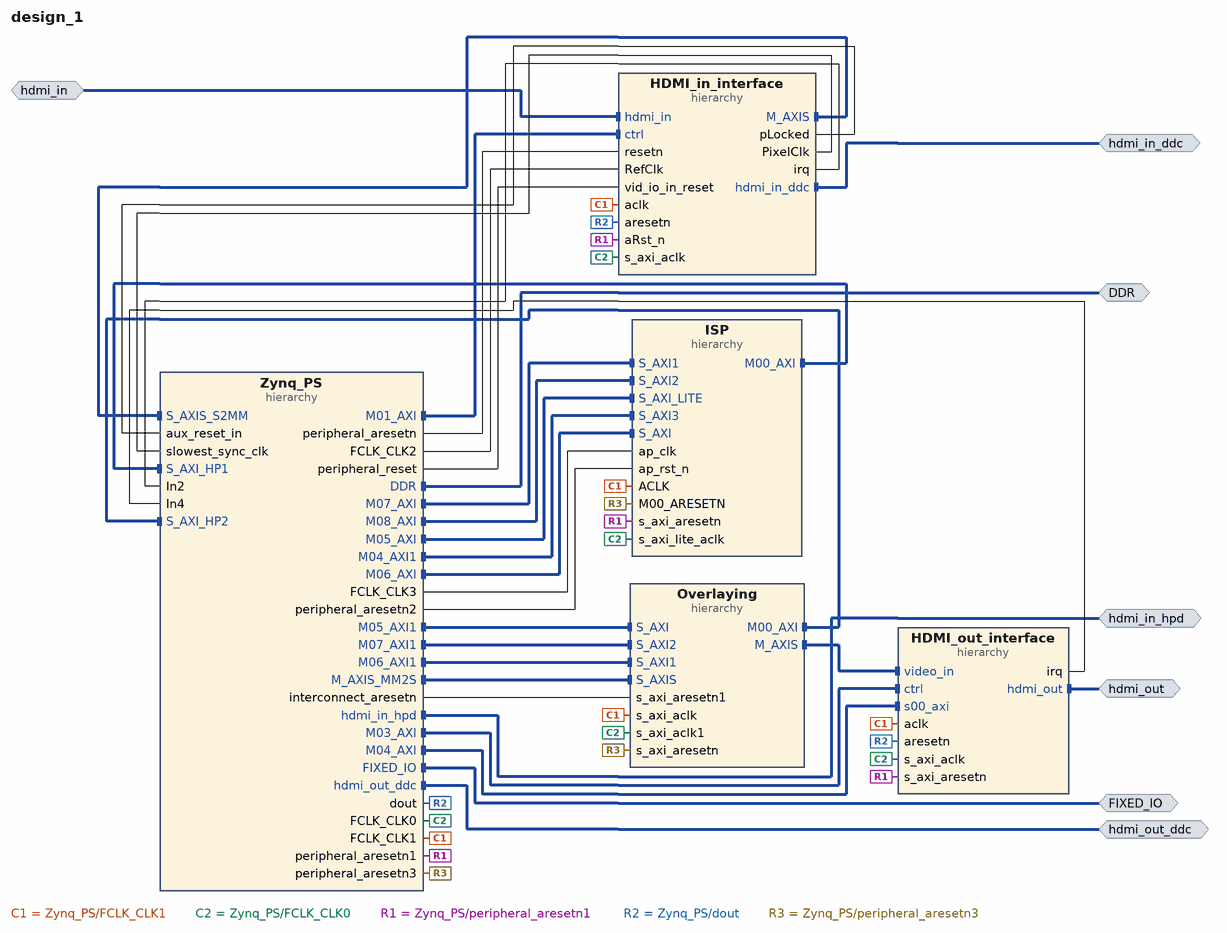
[diagram p0: block diagram of the top level]
# Vivado block design design_1, xc7z020clg400-1, Vivado 2020.2
create_bd_design design_1

create_bd_intf_port -mode Master -vlnv xilinx.com:interface:ddrx_rtl:1.0 DDR
create_bd_intf_port -mode Master -vlnv xilinx.com:display_processing_system7:fixedio_rtl:1.0 FIXED_IO
create_bd_intf_port -mode Slave -vlnv digilentinc.com:interface:tmds_rtl:1.0 hdmi_in
create_bd_intf_port -mode Master -vlnv xilinx.com:interface:iic_rtl:1.0 hdmi_in_ddc
create_bd_intf_port -mode Master -vlnv xilinx.com:interface:gpio_rtl:1.0 hdmi_in_hpd
create_bd_intf_port -mode Master -vlnv digilentinc.com:interface:tmds_rtl:1.0 hdmi_out
create_bd_intf_port -mode Master -vlnv xilinx.com:interface:iic_rtl:1.0 hdmi_out_ddc

create_bd_cell -type hier Zynq_PS
create_bd_cell -type hier HDMI_in_interface
create_bd_cell -type hier HDMI_out_interface
create_bd_cell -type hier ISP
create_bd_cell -type hier Overlaying

# ---- hierarchy /Zynq_PS ----
current_bd_instance /Zynq_PS
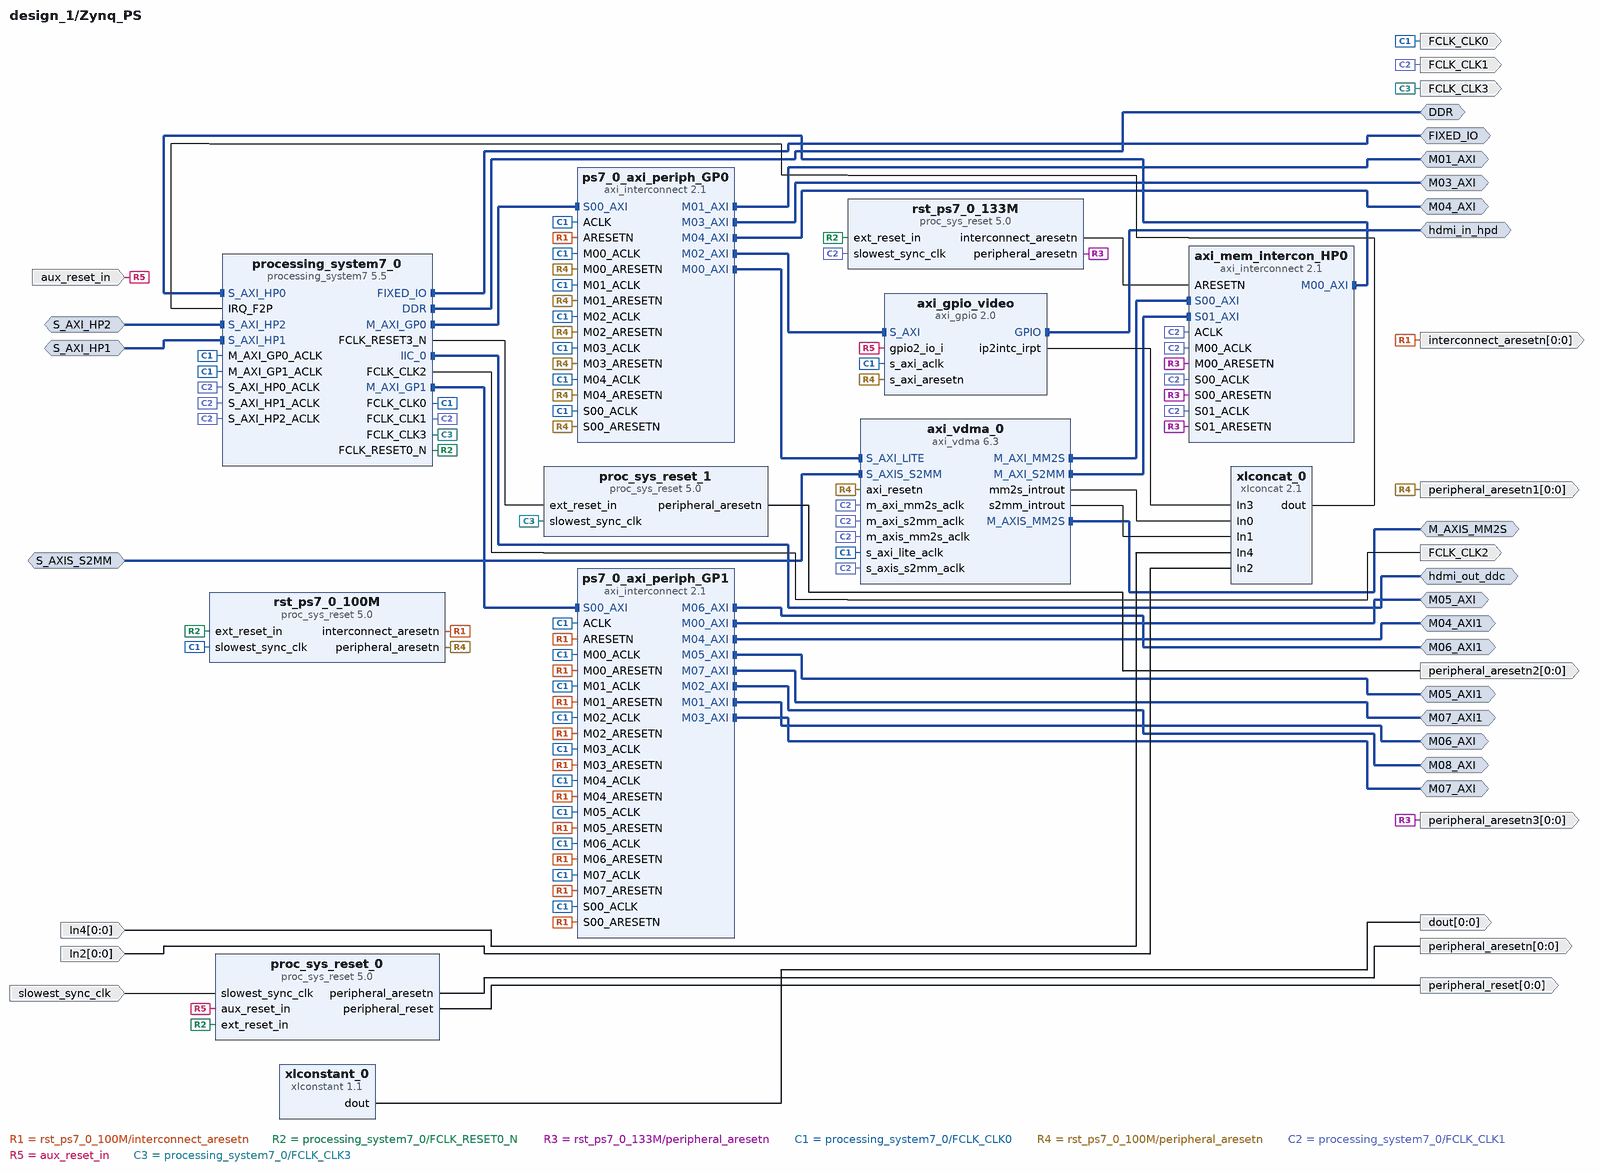
[diagram p1: block diagram inside /Zynq_PS]
create_bd_intf_pin -mode Master -vlnv xilinx.com:interface:ddrx_rtl:1.0 DDR
create_bd_intf_pin -mode Master -vlnv xilinx.com:display_processing_system7:fixedio_rtl:1.0 FIXED_IO
create_bd_intf_pin -mode Master -vlnv xilinx.com:interface:iic_rtl:1.0 hdmi_out_ddc
create_bd_intf_pin -mode Master -vlnv xilinx.com:interface:aximm_rtl:1.0 M03_AXI
create_bd_intf_pin -mode Master -vlnv xilinx.com:interface:axis_rtl:1.0 M_AXIS_MM2S
create_bd_intf_pin -mode Master -vlnv xilinx.com:interface:aximm_rtl:1.0 M04_AXI
create_bd_intf_pin -mode Master -vlnv xilinx.com:interface:aximm_rtl:1.0 M01_AXI
create_bd_intf_pin -mode Slave -vlnv xilinx.com:interface:axis_rtl:1.0 S_AXIS_S2MM
create_bd_intf_pin -mode Master -vlnv xilinx.com:interface:gpio_rtl:1.0 hdmi_in_hpd
create_bd_intf_pin -mode Master -vlnv xilinx.com:interface:aximm_rtl:1.0 M05_AXI
create_bd_intf_pin -mode Master -vlnv xilinx.com:interface:aximm_rtl:1.0 M06_AXI
create_bd_intf_pin -mode Master -vlnv xilinx.com:interface:aximm_rtl:1.0 M07_AXI
create_bd_intf_pin -mode Master -vlnv xilinx.com:interface:aximm_rtl:1.0 M08_AXI
create_bd_intf_pin -mode Slave -vlnv xilinx.com:interface:aximm_rtl:1.0 S_AXI_HP1
create_bd_intf_pin -mode Master -vlnv xilinx.com:interface:aximm_rtl:1.0 M04_AXI1
create_bd_intf_pin -mode Master -vlnv xilinx.com:interface:aximm_rtl:1.0 M05_AXI1
create_bd_intf_pin -mode Master -vlnv xilinx.com:interface:aximm_rtl:1.0 M06_AXI1
create_bd_intf_pin -mode Slave -vlnv xilinx.com:interface:aximm_rtl:1.0 S_AXI_HP2
create_bd_intf_pin -mode Master -vlnv xilinx.com:interface:aximm_rtl:1.0 M07_AXI1
create_bd_pin -dir O -from 0 -to 0 -type rst peripheral_aresetn
create_bd_pin -dir I -from 0 -to 0 In4
create_bd_pin -dir O -type clk FCLK_CLK0
create_bd_pin -dir O -from 0 -to 0 -type rst peripheral_aresetn1
create_bd_pin -dir O -type clk FCLK_CLK2
create_bd_pin -dir O -from 0 -to 0 -type rst peripheral_reset
create_bd_pin -dir O -from 0 -to 0 dout
create_bd_pin -dir O -type clk FCLK_CLK1
create_bd_pin -dir I -type rst aux_reset_in
create_bd_pin -dir I -type clk slowest_sync_clk
create_bd_pin -dir I -from 0 -to 0 In2
create_bd_pin -dir O -type clk FCLK_CLK3
create_bd_pin -dir O -from 0 -to 0 -type rst peripheral_aresetn2
create_bd_pin -dir O -from 0 -to 0 -type rst peripheral_aresetn3
create_bd_pin -dir O -from 0 -to 0 -type rst interconnect_aresetn

create_bd_cell -type ip -vlnv xilinx.com:ip:axi_interconnect:2.1 ps7_0_axi_periph_GP0
set_property -dict {CONFIG.NUM_MI 5} [get_bd_cells ps7_0_axi_periph_GP0]
create_bd_cell -type ip -vlnv xilinx.com:ip:processing_system7:5.5 processing_system7_0
set_property -dict [list \
  CONFIG.PCW_APU_PERIPHERAL_FREQMHZ 667 \
  CONFIG.PCW_ENET0_ENET0_IO {MIO 16 .. 27} \
  CONFIG.PCW_ENET0_GRP_MDIO_ENABLE 1 \
  CONFIG.PCW_ENET0_GRP_MDIO_IO {MIO 52 .. 53} \
  CONFIG.PCW_ENET0_PERIPHERAL_ENABLE 1 \
  CONFIG.PCW_ENET0_RESET_ENABLE 0 \
  CONFIG.PCW_ENET_RESET_ENABLE 1 \
  CONFIG.PCW_ENET_RESET_SELECT {Share reset pin} \
  CONFIG.PCW_EN_CLK1_PORT 1 \
  CONFIG.PCW_EN_CLK2_PORT 1 \
  CONFIG.PCW_EN_CLK3_PORT 1 \
  CONFIG.PCW_EN_RST3_PORT 1 \
  CONFIG.PCW_FCLK1_PERIPHERAL_CLKSRC {DDR PLL} \
  CONFIG.PCW_FCLK_CLK1_BUF TRUE \
  CONFIG.PCW_FCLK_CLK2_BUF TRUE \
  CONFIG.PCW_FCLK_CLK3_BUF TRUE \
  CONFIG.PCW_FPGA0_PERIPHERAL_FREQMHZ 100 \
  CONFIG.PCW_FPGA1_PERIPHERAL_FREQMHZ 133 \
  CONFIG.PCW_FPGA2_PERIPHERAL_FREQMHZ 200 \
  CONFIG.PCW_FPGA3_PERIPHERAL_FREQMHZ 100 \
  CONFIG.PCW_FPGA_FCLK1_ENABLE 1 \
  CONFIG.PCW_FPGA_FCLK2_ENABLE 1 \
  CONFIG.PCW_FPGA_FCLK3_ENABLE 1 \
  CONFIG.PCW_GPIO_MIO_GPIO_ENABLE 1 \
  CONFIG.PCW_GPIO_MIO_GPIO_IO MIO \
  CONFIG.PCW_I2C0_I2C0_IO EMIO \
  CONFIG.PCW_I2C0_PERIPHERAL_ENABLE 1 \
  CONFIG.PCW_I2C_PERIPHERAL_FREQMHZ 111.111115 \
  CONFIG.PCW_I2C_RESET_ENABLE 1 \
  CONFIG.PCW_I2C_RESET_SELECT {Share reset pin} \
  CONFIG.PCW_IRQ_F2P_INTR 1 \
  CONFIG.PCW_PRESET_BANK1_VOLTAGE {LVCMOS 1.8V} \
  CONFIG.PCW_QSPI_GRP_FBCLK_ENABLE 1 \
  CONFIG.PCW_QSPI_GRP_FBCLK_IO {MIO 8} \
  CONFIG.PCW_QSPI_GRP_SINGLE_SS_ENABLE 1 \
  CONFIG.PCW_QSPI_GRP_SINGLE_SS_IO {MIO 1 .. 6} \
  CONFIG.PCW_QSPI_PERIPHERAL_ENABLE 1 \
  CONFIG.PCW_QSPI_QSPI_IO {MIO 1 .. 6} \
  CONFIG.PCW_SD0_GRP_CD_ENABLE 1 \
  CONFIG.PCW_SD0_GRP_CD_IO {MIO 47} \
  CONFIG.PCW_SD0_GRP_WP_ENABLE 0 \
  CONFIG.PCW_SD0_PERIPHERAL_ENABLE 1 \
  CONFIG.PCW_SD0_SD0_IO {MIO 40 .. 45} \
  CONFIG.PCW_SDIO_PERIPHERAL_FREQMHZ 50 \
  CONFIG.PCW_SINGLE_QSPI_DATA_MODE x4 \
  CONFIG.PCW_UART1_PERIPHERAL_ENABLE 1 \
  CONFIG.PCW_UART1_UART1_IO {MIO 48 .. 49} \
  CONFIG.PCW_UART_PERIPHERAL_FREQMHZ 100 \
  CONFIG.PCW_UIPARAM_DDR_FREQ_MHZ 533.333333 \
  CONFIG.PCW_UIPARAM_DDR_MEMORY_TYPE {DDR 3 (Low Voltage)} \
  CONFIG.PCW_UIPARAM_DDR_PARTNO {MT41K256M16 RE-125} \
  CONFIG.PCW_USB0_PERIPHERAL_ENABLE 1 \
  CONFIG.PCW_USB0_RESET_ENABLE 1 \
  CONFIG.PCW_USB0_RESET_IO {MIO 46} \
  CONFIG.PCW_USB0_USB0_IO {MIO 28 .. 39} \
  CONFIG.PCW_USB_RESET_ENABLE 1 \
  CONFIG.PCW_USB_RESET_SELECT {Share reset pin} \
  CONFIG.PCW_USE_FABRIC_INTERRUPT 1 \
  CONFIG.PCW_USE_M_AXI_GP1 1 \
  CONFIG.PCW_USE_S_AXI_HP0 1 \
  CONFIG.PCW_USE_S_AXI_HP1 1 \
  CONFIG.PCW_USE_S_AXI_HP2 1 \
] [get_bd_cells processing_system7_0]
# 298 more settings of processing_system7_0 are not shown: defaults, MIO pin electricals, DDR timing, and values the tool derives
create_bd_cell -type ip -vlnv xilinx.com:ip:axi_vdma:6.3 axi_vdma_0
set_property -dict [list \
  CONFIG.c_m_axis_mm2s_tdata_width 24 \
  CONFIG.c_mm2s_linebuffer_depth 2048 \
  CONFIG.c_s2mm_linebuffer_depth 2048 \
  CONFIG.c_s2mm_max_burst_length 32 \
] [get_bd_cells axi_vdma_0]
create_bd_cell -type ip -vlnv xilinx.com:ip:xlconcat:2.1 xlconcat_0
set_property -dict {CONFIG.NUM_PORTS 5 CONFIG.dout_width 5} [get_bd_cells xlconcat_0]
create_bd_cell -type ip -vlnv xilinx.com:ip:xlconstant:1.1 xlconstant_0
create_bd_cell -type ip -vlnv xilinx.com:ip:axi_interconnect:2.1 axi_mem_intercon_HP0
set_property -dict {CONFIG.NUM_MI 1 CONFIG.NUM_SI 2} [get_bd_cells axi_mem_intercon_HP0]
create_bd_cell -type ip -vlnv xilinx.com:ip:proc_sys_reset:5.0 proc_sys_reset_0
create_bd_cell -type ip -vlnv xilinx.com:ip:proc_sys_reset:5.0 rst_ps7_0_100M
create_bd_cell -type ip -vlnv xilinx.com:ip:proc_sys_reset:5.0 rst_ps7_0_133M
create_bd_cell -type ip -vlnv xilinx.com:ip:axi_gpio:2.0 axi_gpio_video
set_property -dict [list \
  CONFIG.C_ALL_INPUTS_2 1 \
  CONFIG.C_ALL_OUTPUTS 1 \
  CONFIG.C_GPIO2_WIDTH 1 \
  CONFIG.C_GPIO_WIDTH 1 \
  CONFIG.C_INTERRUPT_PRESENT 1 \
  CONFIG.C_IS_DUAL 1 \
] [get_bd_cells axi_gpio_video]
create_bd_cell -type ip -vlnv xilinx.com:ip:proc_sys_reset:5.0 proc_sys_reset_1
create_bd_cell -type ip -vlnv xilinx.com:ip:axi_interconnect:2.1 ps7_0_axi_periph_GP1
set_property -dict {CONFIG.NUM_MI 8} [get_bd_cells ps7_0_axi_periph_GP1]

# ---- hierarchy /HDMI_in_interface ----
current_bd_instance /HDMI_in_interface
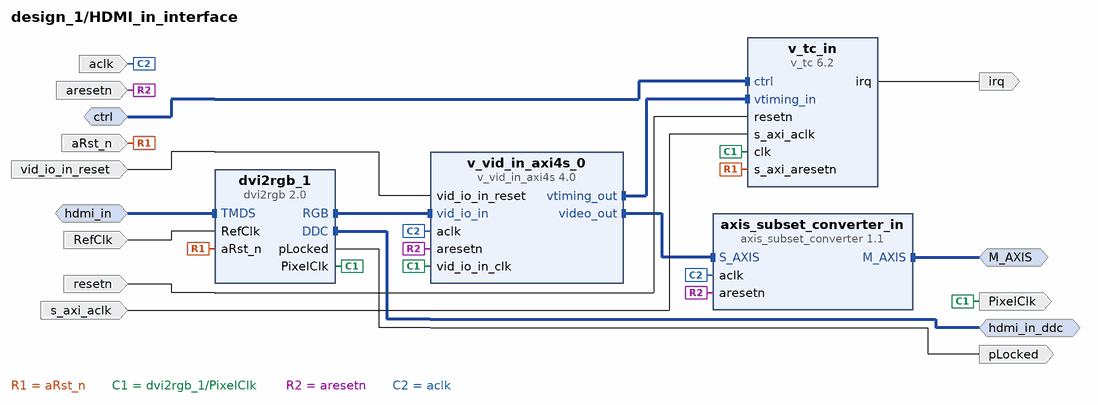
[diagram p2: block diagram inside /HDMI_in_interface]
create_bd_intf_pin -mode Slave -vlnv digilentinc.com:interface:tmds_rtl:1.0 hdmi_in
create_bd_intf_pin -mode Master -vlnv xilinx.com:interface:iic_rtl:1.0 hdmi_in_ddc
create_bd_intf_pin -mode Slave -vlnv xilinx.com:interface:aximm_rtl:1.0 ctrl
create_bd_intf_pin -mode Master -vlnv xilinx.com:interface:axis_rtl:1.0 M_AXIS
create_bd_pin -dir I -type rst aRst_n
create_bd_pin -dir O -type clk PixelClk
create_bd_pin -dir I -type clk RefClk
create_bd_pin -dir O pLocked
create_bd_pin -dir I -type rst vid_io_in_reset
create_bd_pin -dir I -type rst aresetn
create_bd_pin -dir I -type clk aclk
create_bd_pin -dir I -type rst resetn
create_bd_pin -dir O -type intr irq
create_bd_pin -dir I -type clk s_axi_aclk

create_bd_cell -type ip -vlnv digilentinc.com:ip:dvi2rgb:2.0 dvi2rgb_1
set_property -dict [list \
  CONFIG.IIC_BOARD_INTERFACE hdmi_in_ddc \
  CONFIG.TMDS_BOARD_INTERFACE hdmi_in \
  CONFIG.kAddBUFG false \
  CONFIG.kClkRange 1 \
  CONFIG.kDebug false \
  CONFIG.kEdidFileName dgl_1080p_cea.data \
  CONFIG.kRstActiveHigh false \
] [get_bd_cells dvi2rgb_1]
create_bd_cell -type ip -vlnv xilinx.com:ip:v_vid_in_axi4s:4.0 v_vid_in_axi4s_0
set_property -dict {CONFIG.C_ADDR_WIDTH 12 CONFIG.C_HAS_ASYNC_CLK 1} [get_bd_cells v_vid_in_axi4s_0]
create_bd_cell -type ip -vlnv xilinx.com:ip:v_tc:6.2 v_tc_in
set_property -dict [list \
  CONFIG.HAS_INTC_IF true \
  CONFIG.enable_generation false \
  CONFIG.horizontal_blank_detection false \
  CONFIG.vertical_blank_detection false \
] [get_bd_cells v_tc_in]
create_bd_cell -type ip -vlnv xilinx.com:ip:axis_subset_converter:1.1 axis_subset_converter_in
set_property -dict [list \
  CONFIG.M_HAS_TLAST 1 \
  CONFIG.M_TDATA_NUM_BYTES 3 \
  CONFIG.M_TUSER_WIDTH 1 \
  CONFIG.S_HAS_TLAST 1 \
  CONFIG.S_HAS_TREADY 1 \
  CONFIG.S_TDATA_NUM_BYTES 3 \
  CONFIG.S_TUSER_WIDTH 1 \
  CONFIG.TDATA_REMAP {tdata[23:16],tdata[7:0],tdata[15:8]} \
  CONFIG.TLAST_REMAP {tlast[0]} \
  CONFIG.TUSER_REMAP {tuser[0:0]} \
] [get_bd_cells axis_subset_converter_in]

# ---- hierarchy /HDMI_out_interface ----
current_bd_instance /HDMI_out_interface
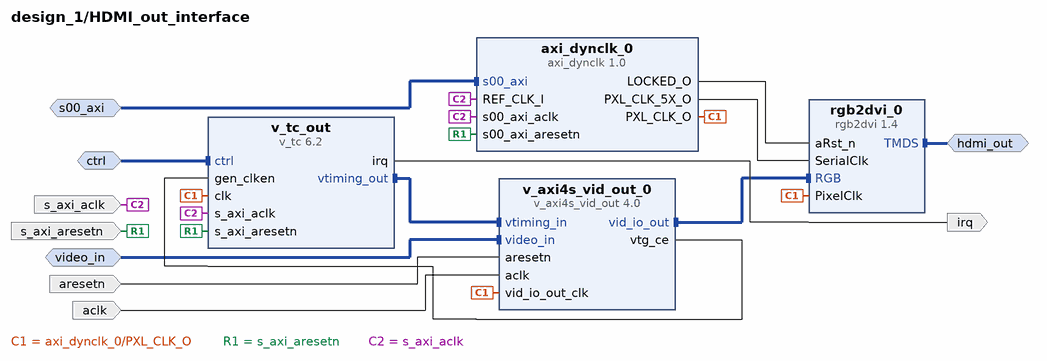
[diagram p3: block diagram inside /HDMI_out_interface]
create_bd_intf_pin -mode Master -vlnv digilentinc.com:interface:tmds_rtl:1.0 hdmi_out
create_bd_intf_pin -mode Slave -vlnv xilinx.com:interface:aximm_rtl:1.0 ctrl
create_bd_intf_pin -mode Slave -vlnv xilinx.com:interface:aximm_rtl:1.0 s00_axi
create_bd_intf_pin -mode Slave -vlnv xilinx.com:interface:axis_rtl:1.0 video_in
create_bd_pin -dir I -type rst aresetn
create_bd_pin -dir I -type clk aclk
create_bd_pin -dir I -type rst s_axi_aresetn
create_bd_pin -dir O -type intr irq
create_bd_pin -dir I -type clk s_axi_aclk

create_bd_cell -type ip -vlnv digilentinc.com:ip:rgb2dvi:1.4 rgb2dvi_0
set_property -dict [list \
  CONFIG.TMDS_BOARD_INTERFACE hdmi_out \
  CONFIG.kGenerateSerialClk false \
  CONFIG.kRstActiveHigh false \
] [get_bd_cells rgb2dvi_0]
create_bd_cell -type ip -vlnv xilinx.com:ip:v_axi4s_vid_out:4.0 v_axi4s_vid_out_0
set_property -dict {CONFIG.C_ADDR_WIDTH 12 CONFIG.C_HAS_ASYNC_CLK 1 CONFIG.C_VTG_MASTER_SLAVE 1} [get_bd_cells v_axi4s_vid_out_0]
create_bd_cell -type ip -vlnv xilinx.com:ip:v_tc:6.2 v_tc_out
set_property -dict {CONFIG.enable_detection false} [get_bd_cells v_tc_out]
create_bd_cell -type ip -vlnv digilentinc.com:ip:axi_dynclk:1.0 axi_dynclk_0

# ---- hierarchy /ISP ----
current_bd_instance /ISP
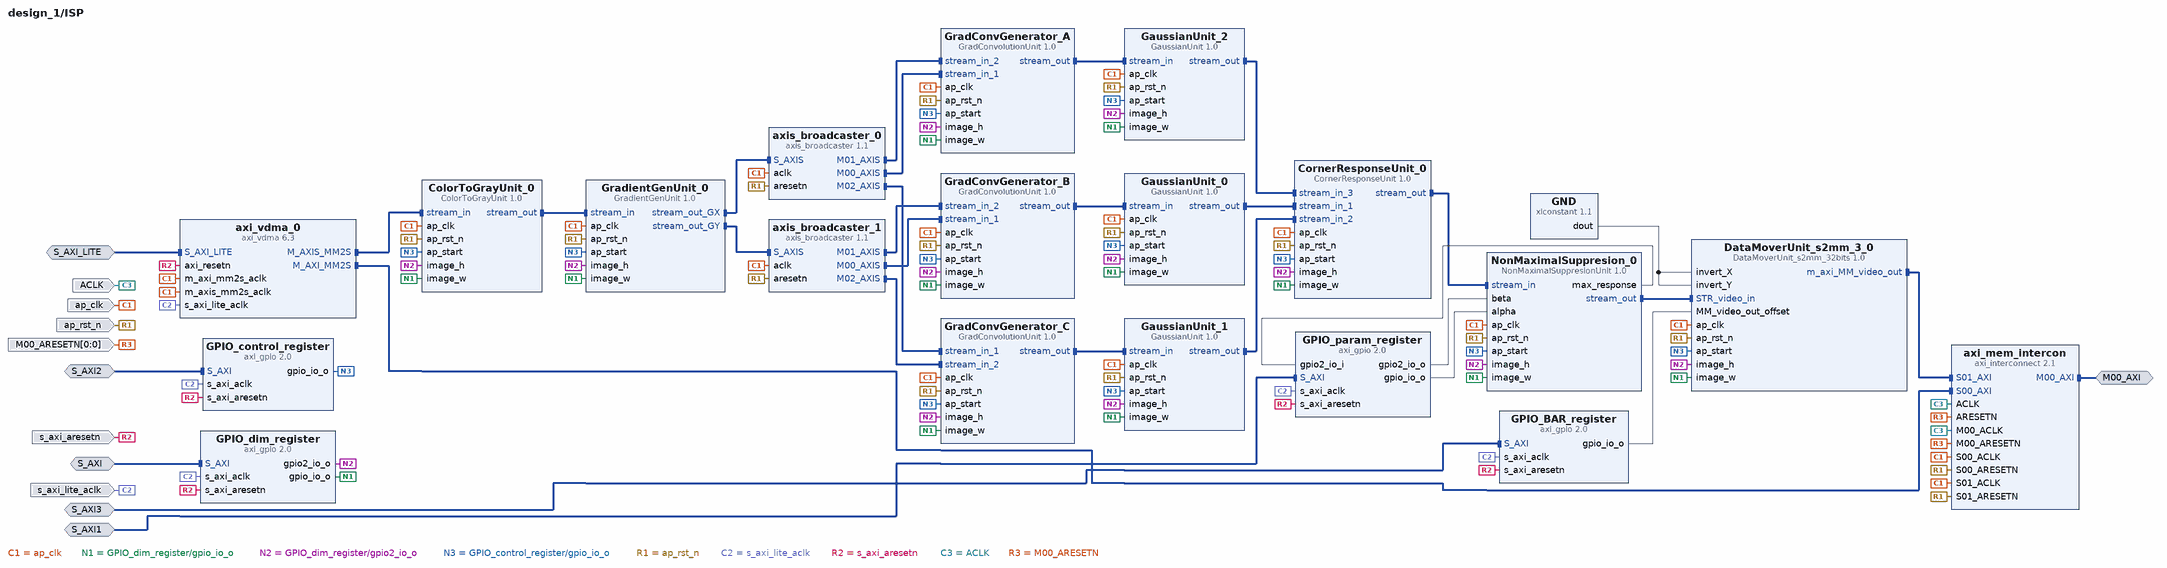
[diagram p4: block diagram inside /ISP]
create_bd_intf_pin -mode Slave -vlnv xilinx.com:interface:aximm_rtl:1.0 S_AXI_LITE
create_bd_intf_pin -mode Slave -vlnv xilinx.com:interface:aximm_rtl:1.0 S_AXI
create_bd_intf_pin -mode Slave -vlnv xilinx.com:interface:aximm_rtl:1.0 S_AXI1
create_bd_intf_pin -mode Slave -vlnv xilinx.com:interface:aximm_rtl:1.0 S_AXI2
create_bd_intf_pin -mode Master -vlnv xilinx.com:interface:aximm_rtl:1.0 M00_AXI
create_bd_intf_pin -mode Slave -vlnv xilinx.com:interface:aximm_rtl:1.0 S_AXI3
create_bd_pin -dir I -type clk ap_clk
create_bd_pin -dir I -type rst ap_rst_n
create_bd_pin -dir I -type clk s_axi_lite_aclk
create_bd_pin -dir I -type rst s_axi_aresetn
create_bd_pin -dir I -type clk ACLK
create_bd_pin -dir I -from 0 -to 0 -type rst M00_ARESETN

create_bd_cell -type ip -vlnv Deverene:DVR-002:GradientGenUnit:1.0 GradientGenUnit_0
create_bd_cell -type ip -vlnv xilinx.com:ip:axis_broadcaster:1.1 axis_broadcaster_0
set_property -dict {CONFIG.M02_TDATA_REMAP {tdata[7:0]} CONFIG.NUM_MI 3} [get_bd_cells axis_broadcaster_0]
create_bd_cell -type ip -vlnv Deverne:DVR-002:GradConvolutionUnit:1.0 GradConvGenerator_A
create_bd_cell -type ip -vlnv Deverne:DVR-002:GradConvolutionUnit:1.0 GradConvGenerator_B
create_bd_cell -type ip -vlnv xilinx.com:ip:axis_broadcaster:1.1 axis_broadcaster_1
set_property -dict {CONFIG.M02_TDATA_REMAP {tdata[7:0]} CONFIG.NUM_MI 3} [get_bd_cells axis_broadcaster_1]
create_bd_cell -type ip -vlnv Deverne:DVR-002:GradConvolutionUnit:1.0 GradConvGenerator_C
create_bd_cell -type ip -vlnv Deverne:DVR-002:GaussianUnit:1.0 GaussianUnit_0
create_bd_cell -type ip -vlnv Deverne:DVR-002:GaussianUnit:1.0 GaussianUnit_1
create_bd_cell -type ip -vlnv Deverne:DVR-002:GaussianUnit:1.0 GaussianUnit_2
create_bd_cell -type ip -vlnv Deverne:DVR-002:CornerResponseUnit:1.0 CornerResponseUnit_0
create_bd_cell -type ip -vlnv xilinx.com:ip:axi_vdma:6.3 axi_vdma_0
set_property -dict [list \
  CONFIG.c_include_s2mm 0 \
  CONFIG.c_m_axis_mm2s_tdata_width 24 \
  CONFIG.c_mm2s_linebuffer_depth 2048 \
  CONFIG.c_num_fstores 1 \
] [get_bd_cells axi_vdma_0]
create_bd_cell -type ip -vlnv xilinx.com:ip:axi_gpio:2.0 GPIO_dim_register
set_property -dict {CONFIG.C_ALL_OUTPUTS 1 CONFIG.C_ALL_OUTPUTS_2 1 CONFIG.C_IS_DUAL 1} [get_bd_cells GPIO_dim_register]
create_bd_cell -type ip -vlnv xilinx.com:ip:axi_gpio:2.0 GPIO_param_register
set_property -dict [list \
  CONFIG.C_ALL_OUTPUTS 1 \
  CONFIG.C_ALL_OUTPUTS_2 0 \
  CONFIG.C_GPIO2_WIDTH 16 \
  CONFIG.C_GPIO_WIDTH 16 \
  CONFIG.C_IS_DUAL 1 \
] [get_bd_cells GPIO_param_register]
create_bd_cell -type ip -vlnv xilinx.com:ip:axi_gpio:2.0 GPIO_control_register
set_property -dict {CONFIG.C_ALL_OUTPUTS 1 CONFIG.C_GPIO_WIDTH 1 CONFIG.C_IS_DUAL 0} [get_bd_cells GPIO_control_register]
create_bd_cell -type ip -vlnv xilinx.com:ip:axi_interconnect:2.1 axi_mem_intercon
set_property -dict {CONFIG.NUM_MI 1 CONFIG.NUM_SI 2} [get_bd_cells axi_mem_intercon]
create_bd_cell -type ip -vlnv Deverne:DVR-002:ColorToGrayUnit:1.0 ColorToGrayUnit_0
create_bd_cell -type ip -vlnv Boutigny_L:PH920:DataMoverUnit_s2mm_32bits:1.0 DataMoverUnit_s2mm_3_0
create_bd_cell -type ip -vlnv xilinx.com:ip:axi_gpio:2.0 GPIO_BAR_register
set_property -dict {CONFIG.C_ALL_OUTPUTS 1 CONFIG.C_IS_DUAL 0} [get_bd_cells GPIO_BAR_register]
create_bd_cell -type ip -vlnv xilinx.com:ip:xlconstant:1.1 GND
set_property -dict {CONFIG.CONST_VAL 0} [get_bd_cells GND]
create_bd_cell -type ip -vlnv Deverne:DVR-002:NonMaximalSuppresionUnit:1.0 NonMaximalSuppresion_0

# ---- hierarchy /Overlaying ----
current_bd_instance /Overlaying
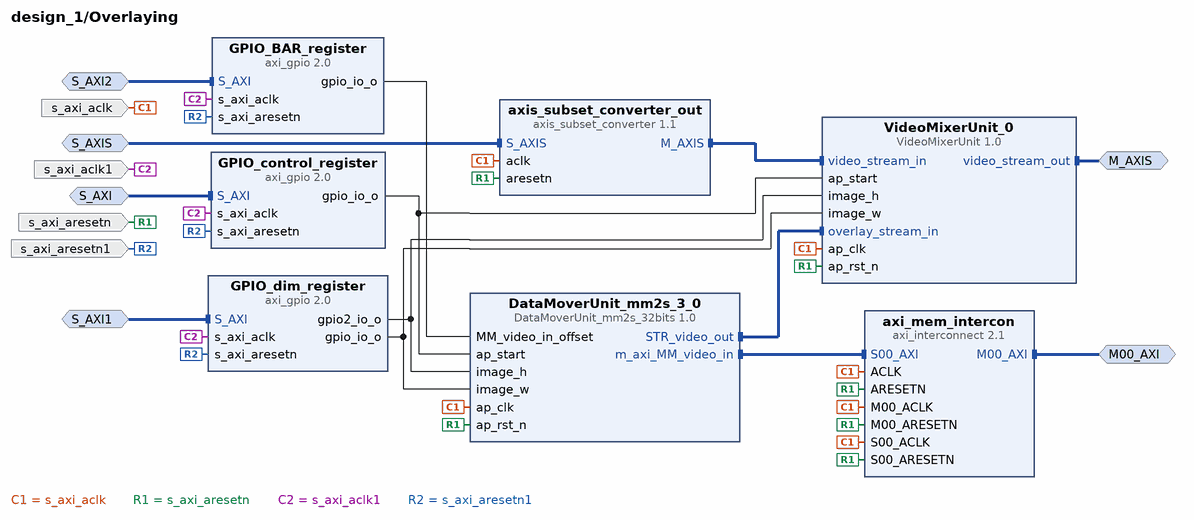
[diagram p5: block diagram inside /Overlaying]
create_bd_intf_pin -mode Slave -vlnv xilinx.com:interface:axis_rtl:1.0 S_AXIS
create_bd_intf_pin -mode Master -vlnv xilinx.com:interface:axis_rtl:1.0 M_AXIS
create_bd_intf_pin -mode Slave -vlnv xilinx.com:interface:aximm_rtl:1.0 S_AXI
create_bd_intf_pin -mode Slave -vlnv xilinx.com:interface:aximm_rtl:1.0 S_AXI1
create_bd_intf_pin -mode Master -vlnv xilinx.com:interface:aximm_rtl:1.0 M00_AXI
create_bd_intf_pin -mode Slave -vlnv xilinx.com:interface:aximm_rtl:1.0 S_AXI2
create_bd_pin -dir I -type clk s_axi_aclk
create_bd_pin -dir I -type rst s_axi_aresetn
create_bd_pin -dir I -type clk s_axi_aclk1
create_bd_pin -dir I -type rst s_axi_aresetn1

create_bd_cell -type ip -vlnv Deverne:DVR-002:DataMoverUnit_mm2s_32bits:1.0 DataMoverUnit_mm2s_3_0
create_bd_cell -type ip -vlnv xilinx.com:ip:axis_subset_converter:1.1 axis_subset_converter_out
set_property -dict [list \
  CONFIG.M_HAS_TKEEP 1 \
  CONFIG.M_HAS_TLAST 1 \
  CONFIG.M_TDATA_NUM_BYTES 3 \
  CONFIG.M_TUSER_WIDTH 1 \
  CONFIG.S_HAS_TKEEP 1 \
  CONFIG.S_HAS_TLAST 1 \
  CONFIG.S_TDATA_NUM_BYTES 3 \
  CONFIG.S_TUSER_WIDTH 1 \
  CONFIG.TDATA_REMAP {tdata[23:16],tdata[7:0],tdata[15:8]} \
  CONFIG.TKEEP_REMAP {tkeep[2:0]} \
  CONFIG.TLAST_REMAP {tlast[0]} \
  CONFIG.TUSER_REMAP {tuser[0:0]} \
] [get_bd_cells axis_subset_converter_out]
create_bd_cell -type ip -vlnv xilinx.com:ip:axi_gpio:2.0 GPIO_control_register
set_property -dict {CONFIG.C_ALL_OUTPUTS 1 CONFIG.C_GPIO_WIDTH 1 CONFIG.C_IS_DUAL 0} [get_bd_cells GPIO_control_register]
create_bd_cell -type ip -vlnv xilinx.com:ip:axi_gpio:2.0 GPIO_dim_register
set_property -dict {CONFIG.C_ALL_OUTPUTS 1 CONFIG.C_ALL_OUTPUTS_2 1 CONFIG.C_IS_DUAL 1} [get_bd_cells GPIO_dim_register]
create_bd_cell -type ip -vlnv xilinx.com:ip:axi_interconnect:2.1 axi_mem_intercon
set_property -dict {CONFIG.NUM_MI 1 CONFIG.NUM_SI 1} [get_bd_cells axi_mem_intercon]
create_bd_cell -type ip -vlnv xilinx.com:ip:axi_gpio:2.0 GPIO_BAR_register
set_property -dict {CONFIG.C_ALL_OUTPUTS 1 CONFIG.C_IS_DUAL 0} [get_bd_cells GPIO_BAR_register]
create_bd_cell -type ip -vlnv Deverne:DVR-002:VideoMixerUnit:1.0 VideoMixerUnit_0

# ---- connections ----

current_bd_instance /Zynq_PS
connect_bd_intf_net -intf_net S_AXI_HP2_1 [get_bd_intf_pins S_AXI_HP2] [get_bd_intf_pins processing_system7_0/S_AXI_HP2]
connect_bd_intf_net [get_bd_intf_pins M06_AXI1] [get_bd_intf_pins ps7_0_axi_periph_GP1/M06_AXI]
connect_bd_intf_net [get_bd_intf_pins M08_AXI] [get_bd_intf_pins ps7_0_axi_periph_GP1/M02_AXI]
connect_bd_intf_net [get_bd_intf_pins FIXED_IO] [get_bd_intf_pins processing_system7_0/FIXED_IO]
connect_bd_intf_net [get_bd_intf_pins ps7_0_axi_periph_GP0/M02_AXI] [get_bd_intf_pins axi_gpio_video/S_AXI]
connect_bd_intf_net [get_bd_intf_pins M07_AXI1] [get_bd_intf_pins ps7_0_axi_periph_GP1/M07_AXI]
connect_bd_intf_net [get_bd_intf_pins axi_mem_intercon_HP0/S00_AXI] [get_bd_intf_pins axi_vdma_0/M_AXI_MM2S]
connect_bd_intf_net [get_bd_intf_pins hdmi_in_hpd] [get_bd_intf_pins axi_gpio_video/GPIO]
connect_bd_intf_net -intf_net S_AXI_HP1_1 [get_bd_intf_pins S_AXI_HP1] [get_bd_intf_pins processing_system7_0/S_AXI_HP1]
connect_bd_intf_net [get_bd_intf_pins M01_AXI] [get_bd_intf_pins ps7_0_axi_periph_GP0/M01_AXI]
connect_bd_intf_net [get_bd_intf_pins M05_AXI] [get_bd_intf_pins ps7_0_axi_periph_GP1/M00_AXI]
connect_bd_intf_net [get_bd_intf_pins axi_mem_intercon_HP0/S01_AXI] [get_bd_intf_pins axi_vdma_0/M_AXI_S2MM]
connect_bd_intf_net [get_bd_intf_pins M05_AXI1] [get_bd_intf_pins ps7_0_axi_periph_GP1/M05_AXI]
connect_bd_intf_net [get_bd_intf_pins M04_AXI1] [get_bd_intf_pins ps7_0_axi_periph_GP1/M04_AXI]
connect_bd_intf_net [get_bd_intf_pins S_AXIS_S2MM] [get_bd_intf_pins axi_vdma_0/S_AXIS_S2MM]
connect_bd_intf_net [get_bd_intf_pins axi_mem_intercon_HP0/M00_AXI] [get_bd_intf_pins processing_system7_0/S_AXI_HP0]
connect_bd_intf_net [get_bd_intf_pins DDR] [get_bd_intf_pins processing_system7_0/DDR]
connect_bd_intf_net [get_bd_intf_pins processing_system7_0/M_AXI_GP0] [get_bd_intf_pins ps7_0_axi_periph_GP0/S00_AXI]
connect_bd_intf_net [get_bd_intf_pins M06_AXI] [get_bd_intf_pins ps7_0_axi_periph_GP1/M01_AXI]
connect_bd_intf_net [get_bd_intf_pins axi_vdma_0/S_AXI_LITE] [get_bd_intf_pins ps7_0_axi_periph_GP0/M00_AXI]
connect_bd_intf_net [get_bd_intf_pins M_AXIS_MM2S] [get_bd_intf_pins axi_vdma_0/M_AXIS_MM2S]
connect_bd_intf_net [get_bd_intf_pins M03_AXI] [get_bd_intf_pins ps7_0_axi_periph_GP0/M03_AXI]
connect_bd_intf_net [get_bd_intf_pins M07_AXI] [get_bd_intf_pins ps7_0_axi_periph_GP1/M03_AXI]
connect_bd_intf_net [get_bd_intf_pins M04_AXI] [get_bd_intf_pins ps7_0_axi_periph_GP0/M04_AXI]
connect_bd_intf_net [get_bd_intf_pins hdmi_out_ddc] [get_bd_intf_pins processing_system7_0/IIC_0]
connect_bd_intf_net [get_bd_intf_pins ps7_0_axi_periph_GP1/S00_AXI] [get_bd_intf_pins processing_system7_0/M_AXI_GP1]
connect_bd_net [get_bd_pins rst_ps7_0_100M/interconnect_aresetn] \
  [get_bd_pins ps7_0_axi_periph_GP0/ARESETN] [get_bd_pins ps7_0_axi_periph_GP1/M03_ARESETN] \
  [get_bd_pins ps7_0_axi_periph_GP1/M02_ARESETN] [get_bd_pins ps7_0_axi_periph_GP1/M01_ARESETN] \
  [get_bd_pins ps7_0_axi_periph_GP1/M00_ARESETN] [get_bd_pins ps7_0_axi_periph_GP1/S00_ARESETN] \
  [get_bd_pins ps7_0_axi_periph_GP1/ARESETN] [get_bd_pins ps7_0_axi_periph_GP1/M04_ARESETN] \
  [get_bd_pins ps7_0_axi_periph_GP1/M07_ARESETN] [get_bd_pins ps7_0_axi_periph_GP1/M06_ARESETN] \
  [get_bd_pins ps7_0_axi_periph_GP1/M05_ARESETN] [get_bd_pins interconnect_aresetn]
connect_bd_net [get_bd_pins xlconcat_0/dout] [get_bd_pins processing_system7_0/IRQ_F2P]
connect_bd_net [get_bd_pins processing_system7_0/FCLK_RESET0_N] \
  [get_bd_pins proc_sys_reset_0/ext_reset_in] [get_bd_pins rst_ps7_0_100M/ext_reset_in] \
  [get_bd_pins rst_ps7_0_133M/ext_reset_in]
connect_bd_net [get_bd_pins axi_vdma_0/mm2s_introut] [get_bd_pins xlconcat_0/In0]
connect_bd_net [get_bd_pins axi_vdma_0/s2mm_introut] [get_bd_pins xlconcat_0/In1]
connect_bd_net [get_bd_pins rst_ps7_0_133M/interconnect_aresetn] [get_bd_pins axi_mem_intercon_HP0/ARESETN]
connect_bd_net [get_bd_pins rst_ps7_0_133M/peripheral_aresetn] \
  [get_bd_pins axi_mem_intercon_HP0/S00_ARESETN] [get_bd_pins axi_mem_intercon_HP0/M00_ARESETN] \
  [get_bd_pins axi_mem_intercon_HP0/S01_ARESETN] [get_bd_pins peripheral_aresetn3]
connect_bd_net [get_bd_pins proc_sys_reset_0/peripheral_aresetn] [get_bd_pins peripheral_aresetn]
connect_bd_net -net In4_1 [get_bd_pins In4] [get_bd_pins xlconcat_0/In4]
connect_bd_net [get_bd_pins processing_system7_0/FCLK_CLK0] \
  [get_bd_pins FCLK_CLK0] [get_bd_pins processing_system7_0/M_AXI_GP0_ACLK] [get_bd_pins axi_vdma_0/s_axi_lite_aclk] \
  [get_bd_pins ps7_0_axi_periph_GP0/S00_ACLK] [get_bd_pins ps7_0_axi_periph_GP0/M00_ACLK] \
  [get_bd_pins ps7_0_axi_periph_GP0/M01_ACLK] [get_bd_pins ps7_0_axi_periph_GP0/M02_ACLK] \
  [get_bd_pins ps7_0_axi_periph_GP0/M03_ACLK] [get_bd_pins ps7_0_axi_periph_GP0/M04_ACLK] \
  [get_bd_pins rst_ps7_0_100M/slowest_sync_clk] [get_bd_pins ps7_0_axi_periph_GP0/ACLK] \
  [get_bd_pins axi_gpio_video/s_axi_aclk] [get_bd_pins processing_system7_0/M_AXI_GP1_ACLK] \
  [get_bd_pins ps7_0_axi_periph_GP1/S00_ACLK] [get_bd_pins ps7_0_axi_periph_GP1/M00_ACLK] \
  [get_bd_pins ps7_0_axi_periph_GP1/M01_ACLK] [get_bd_pins ps7_0_axi_periph_GP1/M02_ACLK] \
  [get_bd_pins ps7_0_axi_periph_GP1/M03_ACLK] [get_bd_pins ps7_0_axi_periph_GP1/ACLK] \
  [get_bd_pins ps7_0_axi_periph_GP1/M04_ACLK] [get_bd_pins ps7_0_axi_periph_GP1/M07_ACLK] \
  [get_bd_pins ps7_0_axi_periph_GP1/M06_ACLK] [get_bd_pins ps7_0_axi_periph_GP1/M05_ACLK]
connect_bd_net [get_bd_pins rst_ps7_0_100M/peripheral_aresetn] \
  [get_bd_pins peripheral_aresetn1] [get_bd_pins axi_vdma_0/axi_resetn] [get_bd_pins ps7_0_axi_periph_GP0/M00_ARESETN] \
  [get_bd_pins ps7_0_axi_periph_GP0/M01_ARESETN] [get_bd_pins ps7_0_axi_periph_GP0/M02_ARESETN] \
  [get_bd_pins ps7_0_axi_periph_GP0/M03_ARESETN] [get_bd_pins ps7_0_axi_periph_GP0/M04_ARESETN] \
  [get_bd_pins ps7_0_axi_periph_GP0/S00_ARESETN] [get_bd_pins axi_gpio_video/s_axi_aresetn]
connect_bd_net [get_bd_pins processing_system7_0/FCLK_CLK2] [get_bd_pins FCLK_CLK2]
connect_bd_net [get_bd_pins proc_sys_reset_0/peripheral_reset] [get_bd_pins peripheral_reset]
connect_bd_net [get_bd_pins xlconstant_0/dout] [get_bd_pins dout]
connect_bd_net [get_bd_pins processing_system7_0/FCLK_CLK1] \
  [get_bd_pins FCLK_CLK1] [get_bd_pins axi_mem_intercon_HP0/ACLK] [get_bd_pins axi_mem_intercon_HP0/S00_ACLK] \
  [get_bd_pins axi_mem_intercon_HP0/M00_ACLK] [get_bd_pins axi_mem_intercon_HP0/S01_ACLK] \
  [get_bd_pins axi_vdma_0/m_axi_mm2s_aclk] [get_bd_pins axi_vdma_0/m_axis_mm2s_aclk] [get_bd_pins axi_vdma_0/m_axi_s2mm_aclk] \
  [get_bd_pins axi_vdma_0/s_axis_s2mm_aclk] [get_bd_pins rst_ps7_0_133M/slowest_sync_clk] \
  [get_bd_pins processing_system7_0/S_AXI_HP0_ACLK] [get_bd_pins processing_system7_0/S_AXI_HP1_ACLK] \
  [get_bd_pins processing_system7_0/S_AXI_HP2_ACLK]
connect_bd_net [get_bd_pins aux_reset_in] [get_bd_pins proc_sys_reset_0/aux_reset_in] [get_bd_pins axi_gpio_video/gpio2_io_i]
connect_bd_net [get_bd_pins slowest_sync_clk] [get_bd_pins proc_sys_reset_0/slowest_sync_clk]
connect_bd_net -net In2_1 [get_bd_pins In2] [get_bd_pins xlconcat_0/In2]
connect_bd_net [get_bd_pins axi_gpio_video/ip2intc_irpt] [get_bd_pins xlconcat_0/In3]
connect_bd_net [get_bd_pins processing_system7_0/FCLK_CLK3] [get_bd_pins FCLK_CLK3] [get_bd_pins proc_sys_reset_1/slowest_sync_clk]
connect_bd_net [get_bd_pins processing_system7_0/FCLK_RESET3_N] [get_bd_pins proc_sys_reset_1/ext_reset_in]
connect_bd_net [get_bd_pins proc_sys_reset_1/peripheral_aresetn] [get_bd_pins peripheral_aresetn2]

current_bd_instance /HDMI_in_interface
connect_bd_intf_net [get_bd_intf_pins M_AXIS] [get_bd_intf_pins axis_subset_converter_in/M_AXIS]
connect_bd_intf_net [get_bd_intf_pins dvi2rgb_1/RGB] [get_bd_intf_pins v_vid_in_axi4s_0/vid_io_in]
connect_bd_intf_net [get_bd_intf_pins hdmi_in] [get_bd_intf_pins dvi2rgb_1/TMDS]
connect_bd_intf_net [get_bd_intf_pins ctrl] [get_bd_intf_pins v_tc_in/ctrl]
connect_bd_intf_net [get_bd_intf_pins v_vid_in_axi4s_0/video_out] [get_bd_intf_pins axis_subset_converter_in/S_AXIS]
connect_bd_intf_net [get_bd_intf_pins hdmi_in_ddc] [get_bd_intf_pins dvi2rgb_1/DDC]
connect_bd_intf_net [get_bd_intf_pins v_vid_in_axi4s_0/vtiming_out] [get_bd_intf_pins v_tc_in/vtiming_in]
connect_bd_net [get_bd_pins aRst_n] [get_bd_pins dvi2rgb_1/aRst_n] [get_bd_pins v_tc_in/s_axi_aresetn]
connect_bd_net [get_bd_pins dvi2rgb_1/PixelClk] [get_bd_pins PixelClk] [get_bd_pins v_vid_in_axi4s_0/vid_io_in_clk] [get_bd_pins v_tc_in/clk]
connect_bd_net [get_bd_pins RefClk] [get_bd_pins dvi2rgb_1/RefClk]
connect_bd_net [get_bd_pins dvi2rgb_1/pLocked] [get_bd_pins pLocked]
connect_bd_net [get_bd_pins vid_io_in_reset] [get_bd_pins v_vid_in_axi4s_0/vid_io_in_reset]
connect_bd_net [get_bd_pins aresetn] [get_bd_pins v_vid_in_axi4s_0/aresetn] [get_bd_pins axis_subset_converter_in/aresetn]
connect_bd_net [get_bd_pins aclk] [get_bd_pins v_vid_in_axi4s_0/aclk] [get_bd_pins axis_subset_converter_in/aclk]
connect_bd_net [get_bd_pins resetn] [get_bd_pins v_tc_in/resetn]
connect_bd_net [get_bd_pins v_tc_in/irq] [get_bd_pins irq]
connect_bd_net [get_bd_pins s_axi_aclk] [get_bd_pins v_tc_in/s_axi_aclk]

current_bd_instance /HDMI_out_interface
connect_bd_intf_net [get_bd_intf_pins hdmi_out] [get_bd_intf_pins rgb2dvi_0/TMDS]
connect_bd_intf_net [get_bd_intf_pins ctrl] [get_bd_intf_pins v_tc_out/ctrl]
connect_bd_intf_net [get_bd_intf_pins s00_axi] [get_bd_intf_pins axi_dynclk_0/s00_axi]
connect_bd_intf_net [get_bd_intf_pins rgb2dvi_0/RGB] [get_bd_intf_pins v_axi4s_vid_out_0/vid_io_out]
connect_bd_intf_net [get_bd_intf_pins v_axi4s_vid_out_0/vtiming_in] [get_bd_intf_pins v_tc_out/vtiming_out]
connect_bd_intf_net [get_bd_intf_pins video_in] [get_bd_intf_pins v_axi4s_vid_out_0/video_in]
connect_bd_net -net PixelClk_1 [get_bd_pins axi_dynclk_0/PXL_CLK_O] \
  [get_bd_pins rgb2dvi_0/PixelClk] [get_bd_pins v_axi4s_vid_out_0/vid_io_out_clk] [get_bd_pins v_tc_out/clk]
connect_bd_net [get_bd_pins aresetn] [get_bd_pins v_axi4s_vid_out_0/aresetn]
connect_bd_net [get_bd_pins aclk] [get_bd_pins v_axi4s_vid_out_0/aclk]
connect_bd_net [get_bd_pins s_axi_aresetn] [get_bd_pins v_tc_out/s_axi_aresetn] [get_bd_pins axi_dynclk_0/s00_axi_aresetn]
connect_bd_net [get_bd_pins v_axi4s_vid_out_0/vtg_ce] [get_bd_pins v_tc_out/gen_clken]
connect_bd_net [get_bd_pins v_tc_out/irq] [get_bd_pins irq]
connect_bd_net [get_bd_pins s_axi_aclk] [get_bd_pins v_tc_out/s_axi_aclk] [get_bd_pins axi_dynclk_0/s00_axi_aclk] [get_bd_pins axi_dynclk_0/REF_CLK_I]
connect_bd_net [get_bd_pins axi_dynclk_0/LOCKED_O] [get_bd_pins rgb2dvi_0/aRst_n]
connect_bd_net [get_bd_pins axi_dynclk_0/PXL_CLK_5X_O] [get_bd_pins rgb2dvi_0/SerialClk]

current_bd_instance /ISP
connect_bd_intf_net [get_bd_intf_pins GradientGenUnit_0/stream_out_GX] [get_bd_intf_pins axis_broadcaster_0/S_AXIS]
connect_bd_intf_net [get_bd_intf_pins S_AXI_LITE] [get_bd_intf_pins axi_vdma_0/S_AXI_LITE]
connect_bd_intf_net [get_bd_intf_pins axis_broadcaster_0/M02_AXIS] [get_bd_intf_pins GradConvGenerator_C/stream_in_1]
connect_bd_intf_net [get_bd_intf_pins GradConvGenerator_A/stream_in_2] [get_bd_intf_pins axis_broadcaster_0/M01_AXIS]
connect_bd_intf_net [get_bd_intf_pins CornerResponseUnit_0/stream_in_3] [get_bd_intf_pins GaussianUnit_2/stream_out]
connect_bd_intf_net [get_bd_intf_pins GaussianUnit_1/stream_out] [get_bd_intf_pins CornerResponseUnit_0/stream_in_2]
connect_bd_intf_net [get_bd_intf_pins axis_broadcaster_1/S_AXIS] [get_bd_intf_pins GradientGenUnit_0/stream_out_GY]
connect_bd_intf_net -intf_net S_AXI3_1 [get_bd_intf_pins S_AXI3] [get_bd_intf_pins GPIO_BAR_register/S_AXI]
connect_bd_intf_net [get_bd_intf_pins GaussianUnit_2/stream_in] [get_bd_intf_pins GradConvGenerator_A/stream_out]
connect_bd_intf_net [get_bd_intf_pins axis_broadcaster_1/M02_AXIS] [get_bd_intf_pins GradConvGenerator_C/stream_in_2]
connect_bd_intf_net [get_bd_intf_pins S_AXI] [get_bd_intf_pins GPIO_dim_register/S_AXI]
connect_bd_intf_net [get_bd_intf_pins GaussianUnit_1/stream_in] [get_bd_intf_pins GradConvGenerator_C/stream_out]
connect_bd_intf_net [get_bd_intf_pins NonMaximalSuppresion_0/stream_in] [get_bd_intf_pins CornerResponseUnit_0/stream_out]
connect_bd_intf_net [get_bd_intf_pins NonMaximalSuppresion_0/stream_out] [get_bd_intf_pins DataMoverUnit_s2mm_3_0/STR_video_in]
connect_bd_intf_net [get_bd_intf_pins GaussianUnit_0/stream_in] [get_bd_intf_pins GradConvGenerator_B/stream_out]
connect_bd_intf_net [get_bd_intf_pins ColorToGrayUnit_0/stream_out] [get_bd_intf_pins GradientGenUnit_0/stream_in]
connect_bd_intf_net [get_bd_intf_pins DataMoverUnit_s2mm_3_0/m_axi_MM_video_out] [get_bd_intf_pins axi_mem_intercon/S01_AXI]
connect_bd_intf_net [get_bd_intf_pins axis_broadcaster_1/M01_AXIS] [get_bd_intf_pins GradConvGenerator_B/stream_in_2]
connect_bd_intf_net [get_bd_intf_pins CornerResponseUnit_0/stream_in_1] [get_bd_intf_pins GaussianUnit_0/stream_out]
connect_bd_intf_net [get_bd_intf_pins axi_vdma_0/M_AXI_MM2S] [get_bd_intf_pins axi_mem_intercon/S00_AXI]
connect_bd_intf_net [get_bd_intf_pins GradConvGenerator_A/stream_in_1] [get_bd_intf_pins axis_broadcaster_0/M00_AXIS]
connect_bd_intf_net -intf_net S_AXI2_1 [get_bd_intf_pins S_AXI2] [get_bd_intf_pins GPIO_control_register/S_AXI]
connect_bd_intf_net -intf_net S_AXI1_1 [get_bd_intf_pins S_AXI1] [get_bd_intf_pins GPIO_param_register/S_AXI]
connect_bd_intf_net [get_bd_intf_pins axi_vdma_0/M_AXIS_MM2S] [get_bd_intf_pins ColorToGrayUnit_0/stream_in]
connect_bd_intf_net [get_bd_intf_pins axis_broadcaster_1/M00_AXIS] [get_bd_intf_pins GradConvGenerator_B/stream_in_1]
connect_bd_intf_net [get_bd_intf_pins M00_AXI] [get_bd_intf_pins axi_mem_intercon/M00_AXI]
connect_bd_net [get_bd_pins ap_clk] \
  [get_bd_pins GradientGenUnit_0/ap_clk] [get_bd_pins axis_broadcaster_0/aclk] [get_bd_pins GradConvGenerator_A/ap_clk] \
  [get_bd_pins axis_broadcaster_1/aclk] [get_bd_pins GradConvGenerator_B/ap_clk] [get_bd_pins GradConvGenerator_C/ap_clk] \
  [get_bd_pins GaussianUnit_0/ap_clk] [get_bd_pins GaussianUnit_1/ap_clk] [get_bd_pins GaussianUnit_2/ap_clk] \
  [get_bd_pins CornerResponseUnit_0/ap_clk] [get_bd_pins axi_vdma_0/m_axi_mm2s_aclk] \
  [get_bd_pins axi_vdma_0/m_axis_mm2s_aclk] [get_bd_pins axi_mem_intercon/S00_ACLK] [get_bd_pins axi_mem_intercon/S01_ACLK] \
  [get_bd_pins ColorToGrayUnit_0/ap_clk] [get_bd_pins DataMoverUnit_s2mm_3_0/ap_clk] \
  [get_bd_pins NonMaximalSuppresion_0/ap_clk]
connect_bd_net [get_bd_pins GPIO_dim_register/gpio_io_o] \
  [get_bd_pins GradientGenUnit_0/image_w] [get_bd_pins GradConvGenerator_A/image_w] [get_bd_pins GradConvGenerator_B/image_w] \
  [get_bd_pins GradConvGenerator_C/image_w] [get_bd_pins GaussianUnit_0/image_w] [get_bd_pins GaussianUnit_1/image_w] \
  [get_bd_pins GaussianUnit_2/image_w] [get_bd_pins CornerResponseUnit_0/image_w] [get_bd_pins ColorToGrayUnit_0/image_w] \
  [get_bd_pins DataMoverUnit_s2mm_3_0/image_w] [get_bd_pins NonMaximalSuppresion_0/image_w]
connect_bd_net [get_bd_pins GPIO_dim_register/gpio2_io_o] \
  [get_bd_pins GradientGenUnit_0/image_h] [get_bd_pins GradConvGenerator_A/image_h] [get_bd_pins GradConvGenerator_B/image_h] \
  [get_bd_pins GradConvGenerator_C/image_h] [get_bd_pins GaussianUnit_0/image_h] [get_bd_pins GaussianUnit_1/image_h] \
  [get_bd_pins GaussianUnit_2/image_h] [get_bd_pins CornerResponseUnit_0/image_h] [get_bd_pins ColorToGrayUnit_0/image_h] \
  [get_bd_pins DataMoverUnit_s2mm_3_0/image_h] [get_bd_pins NonMaximalSuppresion_0/image_h]
connect_bd_net [get_bd_pins GPIO_control_register/gpio_io_o] \
  [get_bd_pins GradientGenUnit_0/ap_start] [get_bd_pins GradConvGenerator_A/ap_start] \
  [get_bd_pins GradConvGenerator_B/ap_start] [get_bd_pins GradConvGenerator_C/ap_start] [get_bd_pins GaussianUnit_0/ap_start] \
  [get_bd_pins GaussianUnit_1/ap_start] [get_bd_pins GaussianUnit_2/ap_start] [get_bd_pins CornerResponseUnit_0/ap_start] \
  [get_bd_pins ColorToGrayUnit_0/ap_start] [get_bd_pins DataMoverUnit_s2mm_3_0/ap_start] \
  [get_bd_pins NonMaximalSuppresion_0/ap_start]
connect_bd_net [get_bd_pins ap_rst_n] \
  [get_bd_pins GradientGenUnit_0/ap_rst_n] [get_bd_pins axis_broadcaster_0/aresetn] \
  [get_bd_pins GradConvGenerator_A/ap_rst_n] [get_bd_pins axis_broadcaster_1/aresetn] \
  [get_bd_pins GradConvGenerator_B/ap_rst_n] [get_bd_pins GradConvGenerator_C/ap_rst_n] [get_bd_pins GaussianUnit_0/ap_rst_n] \
  [get_bd_pins GaussianUnit_1/ap_rst_n] [get_bd_pins GaussianUnit_2/ap_rst_n] [get_bd_pins CornerResponseUnit_0/ap_rst_n] \
  [get_bd_pins axi_mem_intercon/S00_ARESETN] [get_bd_pins axi_mem_intercon/S01_ARESETN] \
  [get_bd_pins ColorToGrayUnit_0/ap_rst_n] [get_bd_pins DataMoverUnit_s2mm_3_0/ap_rst_n] \
  [get_bd_pins NonMaximalSuppresion_0/ap_rst_n]
connect_bd_net [get_bd_pins s_axi_lite_aclk] \
  [get_bd_pins axi_vdma_0/s_axi_lite_aclk] [get_bd_pins GPIO_dim_register/s_axi_aclk] \
  [get_bd_pins GPIO_param_register/s_axi_aclk] [get_bd_pins GPIO_control_register/s_axi_aclk] \
  [get_bd_pins GPIO_BAR_register/s_axi_aclk]
connect_bd_net -net ISP_param_register_gpio2_io_o [get_bd_pins GPIO_param_register/gpio2_io_o] [get_bd_pins NonMaximalSuppresion_0/beta]
connect_bd_net -net ISP_param_register_gpio_io_o [get_bd_pins GPIO_param_register/gpio_io_o] [get_bd_pins NonMaximalSuppresion_0/alpha]
connect_bd_net [get_bd_pins s_axi_aresetn] \
  [get_bd_pins GPIO_dim_register/s_axi_aresetn] [get_bd_pins GPIO_control_register/s_axi_aresetn] \
  [get_bd_pins GPIO_param_register/s_axi_aresetn] [get_bd_pins axi_vdma_0/axi_resetn] \
  [get_bd_pins GPIO_BAR_register/s_axi_aresetn]
connect_bd_net [get_bd_pins ACLK] [get_bd_pins axi_mem_intercon/ACLK] [get_bd_pins axi_mem_intercon/M00_ACLK]
connect_bd_net [get_bd_pins M00_ARESETN] [get_bd_pins axi_mem_intercon/M00_ARESETN] [get_bd_pins axi_mem_intercon/ARESETN]
connect_bd_net [get_bd_pins GPIO_BAR_register/gpio_io_o] [get_bd_pins DataMoverUnit_s2mm_3_0/MM_video_out_offset]
connect_bd_net [get_bd_pins GND/dout] [get_bd_pins DataMoverUnit_s2mm_3_0/invert_X] [get_bd_pins DataMoverUnit_s2mm_3_0/invert_Y]
connect_bd_net [get_bd_pins NonMaximalSuppresion_0/max_response] [get_bd_pins GPIO_param_register/gpio2_io_i]

current_bd_instance /Overlaying
connect_bd_intf_net [get_bd_intf_pins DataMoverUnit_mm2s_3_0/STR_video_out] [get_bd_intf_pins VideoMixerUnit_0/overlay_stream_in]
connect_bd_intf_net [get_bd_intf_pins M00_AXI] [get_bd_intf_pins axi_mem_intercon/M00_AXI]
connect_bd_intf_net -intf_net S_AXI2_1 [get_bd_intf_pins S_AXI2] [get_bd_intf_pins GPIO_BAR_register/S_AXI]
connect_bd_intf_net [get_bd_intf_pins axi_mem_intercon/S00_AXI] [get_bd_intf_pins DataMoverUnit_mm2s_3_0/m_axi_MM_video_in]
connect_bd_intf_net [get_bd_intf_pins VideoMixerUnit_0/video_stream_in] [get_bd_intf_pins axis_subset_converter_out/M_AXIS]
connect_bd_intf_net [get_bd_intf_pins S_AXIS] [get_bd_intf_pins axis_subset_converter_out/S_AXIS]
connect_bd_intf_net [get_bd_intf_pins M_AXIS] [get_bd_intf_pins VideoMixerUnit_0/video_stream_out]
connect_bd_intf_net [get_bd_intf_pins S_AXI] [get_bd_intf_pins GPIO_control_register/S_AXI]
connect_bd_intf_net -intf_net S_AXI1_1 [get_bd_intf_pins S_AXI1] [get_bd_intf_pins GPIO_dim_register/S_AXI]
connect_bd_net [get_bd_pins GPIO_dim_register/gpio2_io_o] [get_bd_pins DataMoverUnit_mm2s_3_0/image_h] [get_bd_pins VideoMixerUnit_0/image_h]
connect_bd_net [get_bd_pins GPIO_dim_register/gpio_io_o] [get_bd_pins DataMoverUnit_mm2s_3_0/image_w] [get_bd_pins VideoMixerUnit_0/image_w]
connect_bd_net [get_bd_pins GPIO_control_register/gpio_io_o] [get_bd_pins DataMoverUnit_mm2s_3_0/ap_start] [get_bd_pins VideoMixerUnit_0/ap_start]
connect_bd_net [get_bd_pins s_axi_aclk] \
  [get_bd_pins axis_subset_converter_out/aclk] [get_bd_pins DataMoverUnit_mm2s_3_0/ap_clk] \
  [get_bd_pins axi_mem_intercon/ACLK] [get_bd_pins axi_mem_intercon/M00_ACLK] [get_bd_pins axi_mem_intercon/S00_ACLK] \
  [get_bd_pins VideoMixerUnit_0/ap_clk]
connect_bd_net [get_bd_pins s_axi_aresetn] \
  [get_bd_pins axis_subset_converter_out/aresetn] [get_bd_pins DataMoverUnit_mm2s_3_0/ap_rst_n] \
  [get_bd_pins axi_mem_intercon/ARESETN] [get_bd_pins axi_mem_intercon/M00_ARESETN] \
  [get_bd_pins axi_mem_intercon/S00_ARESETN] [get_bd_pins VideoMixerUnit_0/ap_rst_n]
connect_bd_net [get_bd_pins GPIO_BAR_register/gpio_io_o] [get_bd_pins DataMoverUnit_mm2s_3_0/MM_video_in_offset]
connect_bd_net [get_bd_pins s_axi_aclk1] \
  [get_bd_pins GPIO_dim_register/s_axi_aclk] [get_bd_pins GPIO_control_register/s_axi_aclk] \
  [get_bd_pins GPIO_BAR_register/s_axi_aclk]
connect_bd_net [get_bd_pins s_axi_aresetn1] \
  [get_bd_pins GPIO_dim_register/s_axi_aresetn] [get_bd_pins GPIO_control_register/s_axi_aresetn] \
  [get_bd_pins GPIO_BAR_register/s_axi_aresetn]

current_bd_instance /
connect_bd_intf_net [get_bd_intf_pins Zynq_PS/M07_AXI] [get_bd_intf_pins ISP/S_AXI1]
connect_bd_intf_net [get_bd_intf_pins HDMI_out_interface/ctrl] [get_bd_intf_pins Zynq_PS/M03_AXI]
connect_bd_intf_net [get_bd_intf_pins HDMI_out_interface/video_in] [get_bd_intf_pins Overlaying/M_AXIS]
connect_bd_intf_net [get_bd_intf_pins Zynq_PS/M08_AXI] [get_bd_intf_pins ISP/S_AXI2]
connect_bd_intf_net [get_bd_intf_ports DDR] [get_bd_intf_pins Zynq_PS/DDR]
connect_bd_intf_net [get_bd_intf_ports hdmi_in_hpd] [get_bd_intf_pins Zynq_PS/hdmi_in_hpd]
connect_bd_intf_net [get_bd_intf_pins Zynq_PS/M05_AXI] [get_bd_intf_pins ISP/S_AXI_LITE]
connect_bd_intf_net [get_bd_intf_pins HDMI_out_interface/s00_axi] [get_bd_intf_pins Zynq_PS/M04_AXI]
connect_bd_intf_net [get_bd_intf_pins HDMI_in_interface/ctrl] [get_bd_intf_pins Zynq_PS/M01_AXI]
connect_bd_intf_net [get_bd_intf_pins HDMI_in_interface/M_AXIS] [get_bd_intf_pins Zynq_PS/S_AXIS_S2MM]
connect_bd_intf_net [get_bd_intf_pins Zynq_PS/M04_AXI1] [get_bd_intf_pins ISP/S_AXI3]
connect_bd_intf_net [get_bd_intf_pins Zynq_PS/M05_AXI1] [get_bd_intf_pins Overlaying/S_AXI]
connect_bd_intf_net [get_bd_intf_pins Overlaying/M00_AXI] [get_bd_intf_pins Zynq_PS/S_AXI_HP2]
connect_bd_intf_net [get_bd_intf_pins Zynq_PS/M07_AXI1] [get_bd_intf_pins Overlaying/S_AXI2]
connect_bd_intf_net [get_bd_intf_ports hdmi_in_ddc] [get_bd_intf_pins HDMI_in_interface/hdmi_in_ddc]
connect_bd_intf_net [get_bd_intf_pins Zynq_PS/M06_AXI1] [get_bd_intf_pins Overlaying/S_AXI1]
connect_bd_intf_net [get_bd_intf_pins ISP/M00_AXI] [get_bd_intf_pins Zynq_PS/S_AXI_HP1]
connect_bd_intf_net [get_bd_intf_pins Zynq_PS/M_AXIS_MM2S] [get_bd_intf_pins Overlaying/S_AXIS]
connect_bd_intf_net [get_bd_intf_ports FIXED_IO] [get_bd_intf_pins Zynq_PS/FIXED_IO]
connect_bd_intf_net [get_bd_intf_ports hdmi_out_ddc] [get_bd_intf_pins Zynq_PS/hdmi_out_ddc]
connect_bd_intf_net [get_bd_intf_ports hdmi_out] [get_bd_intf_pins HDMI_out_interface/hdmi_out]
connect_bd_intf_net [get_bd_intf_pins Zynq_PS/M06_AXI] [get_bd_intf_pins ISP/S_AXI]
connect_bd_intf_net [get_bd_intf_ports hdmi_in] [get_bd_intf_pins HDMI_in_interface/hdmi_in]
connect_bd_net [get_bd_pins Zynq_PS/FCLK_CLK1] \
  [get_bd_pins HDMI_in_interface/aclk] [get_bd_pins HDMI_out_interface/aclk] [get_bd_pins ISP/ACLK] \
  [get_bd_pins Overlaying/s_axi_aclk]
connect_bd_net -net dvi2rgb_0_aPixelClkLckd [get_bd_pins HDMI_in_interface/pLocked] [get_bd_pins Zynq_PS/aux_reset_in]
connect_bd_net -net processing_system7_0_FCLK_CLK0 [get_bd_pins Zynq_PS/FCLK_CLK0] \
  [get_bd_pins HDMI_in_interface/s_axi_aclk] [get_bd_pins HDMI_out_interface/s_axi_aclk] [get_bd_pins ISP/s_axi_lite_aclk] \
  [get_bd_pins Overlaying/s_axi_aclk1]
connect_bd_net -net rst_ps7_0_100M_peripheral_aresetn [get_bd_pins Zynq_PS/peripheral_aresetn1] \
  [get_bd_pins HDMI_in_interface/aRst_n] [get_bd_pins HDMI_out_interface/s_axi_aresetn] [get_bd_pins ISP/s_axi_aresetn]
connect_bd_net -net xlconstant_0_dout [get_bd_pins Zynq_PS/dout] [get_bd_pins HDMI_in_interface/aresetn] [get_bd_pins HDMI_out_interface/aresetn]
connect_bd_net -net resetn_1 [get_bd_pins Zynq_PS/peripheral_aresetn] [get_bd_pins HDMI_in_interface/resetn]
connect_bd_net [get_bd_pins HDMI_out_interface/irq] [get_bd_pins Zynq_PS/In4]
connect_bd_net -net RefClk_1 [get_bd_pins Zynq_PS/FCLK_CLK2] [get_bd_pins HDMI_in_interface/RefClk]
connect_bd_net -net vid_io_in_reset_1 [get_bd_pins Zynq_PS/peripheral_reset] [get_bd_pins HDMI_in_interface/vid_io_in_reset]
connect_bd_net [get_bd_pins HDMI_in_interface/PixelClk] [get_bd_pins Zynq_PS/slowest_sync_clk]
connect_bd_net [get_bd_pins HDMI_in_interface/irq] [get_bd_pins Zynq_PS/In2]
connect_bd_net [get_bd_pins Zynq_PS/FCLK_CLK3] [get_bd_pins ISP/ap_clk]
connect_bd_net -net ap_rst_n_1 [get_bd_pins Zynq_PS/peripheral_aresetn2] [get_bd_pins ISP/ap_rst_n]
connect_bd_net [get_bd_pins Zynq_PS/peripheral_aresetn3] [get_bd_pins ISP/M00_ARESETN] [get_bd_pins Overlaying/s_axi_aresetn]
connect_bd_net -net s_axi_aresetn1_1 [get_bd_pins Zynq_PS/interconnect_aresetn] [get_bd_pins Overlaying/s_axi_aresetn1]

# ---- address map ----
assign_bd_address -offset 0x00000000 -range 1G -target_address_space [get_bd_addr_spaces ISP/axi_vdma_0/Data_MM2S] [get_bd_addr_segs Zynq_PS/processing_system7_0/S_AXI_HP1/HP1_DDR_LOWOCM]
assign_bd_address -offset 0x00000000 -range 1G -target_address_space [get_bd_addr_spaces ISP/DataMoverUnit_s2mm_3_0/Data_m_axi_MM_video_out] [get_bd_addr_segs Zynq_PS/processing_system7_0/S_AXI_HP1/HP1_DDR_LOWOCM]
assign_bd_address -offset 0x00000000 -range 1G -target_address_space [get_bd_addr_spaces Overlaying/DataMoverUnit_mm2s_3_0/Data_m_axi_MM_video_in] [get_bd_addr_segs Zynq_PS/processing_system7_0/S_AXI_HP2/HP2_DDR_LOWOCM]
assign_bd_address -offset 0x00000000 -range 1G -target_address_space [get_bd_addr_spaces Zynq_PS/axi_vdma_0/Data_MM2S] [get_bd_addr_segs Zynq_PS/processing_system7_0/S_AXI_HP0/HP0_DDR_LOWOCM]
assign_bd_address -offset 0x00000000 -range 1G -target_address_space [get_bd_addr_spaces Zynq_PS/axi_vdma_0/Data_S2MM] [get_bd_addr_segs Zynq_PS/processing_system7_0/S_AXI_HP0/HP0_DDR_LOWOCM]
assign_bd_address -offset 0x41200000 -range 64K -target_address_space [get_bd_addr_spaces Zynq_PS/processing_system7_0/Data] [get_bd_addr_segs Zynq_PS/axi_gpio_video/S_AXI/Reg]
assign_bd_address -offset 0x43000000 -range 64K -target_address_space [get_bd_addr_spaces Zynq_PS/processing_system7_0/Data] [get_bd_addr_segs Zynq_PS/axi_vdma_0/S_AXI_LITE/Reg]
assign_bd_address -offset 0x43C00000 -range 64K -target_address_space [get_bd_addr_spaces Zynq_PS/processing_system7_0/Data] [get_bd_addr_segs HDMI_in_interface/v_tc_in/ctrl/Reg]
assign_bd_address -offset 0x43C10000 -range 64K -target_address_space [get_bd_addr_spaces Zynq_PS/processing_system7_0/Data] [get_bd_addr_segs HDMI_out_interface/axi_dynclk_0/s00_axi/reg0]
assign_bd_address -offset 0x43C20000 -range 64K -target_address_space [get_bd_addr_spaces Zynq_PS/processing_system7_0/Data] [get_bd_addr_segs HDMI_out_interface/v_tc_out/ctrl/Reg]
assign_bd_address -offset 0x81200000 -range 64K -target_address_space [get_bd_addr_spaces Zynq_PS/processing_system7_0/Data] [get_bd_addr_segs ISP/GPIO_BAR_register/S_AXI/Reg]
assign_bd_address -offset 0x81210000 -range 64K -target_address_space [get_bd_addr_spaces Zynq_PS/processing_system7_0/Data] [get_bd_addr_segs ISP/GPIO_control_register/S_AXI/Reg]
assign_bd_address -offset 0x81220000 -range 64K -target_address_space [get_bd_addr_spaces Zynq_PS/processing_system7_0/Data] [get_bd_addr_segs ISP/GPIO_dim_register/S_AXI/Reg]
assign_bd_address -offset 0x81230000 -range 64K -target_address_space [get_bd_addr_spaces Zynq_PS/processing_system7_0/Data] [get_bd_addr_segs ISP/GPIO_param_register/S_AXI/Reg]
assign_bd_address -offset 0x81240000 -range 64K -target_address_space [get_bd_addr_spaces Zynq_PS/processing_system7_0/Data] [get_bd_addr_segs Overlaying/GPIO_control_register/S_AXI/Reg]
assign_bd_address -offset 0x81250000 -range 64K -target_address_space [get_bd_addr_spaces Zynq_PS/processing_system7_0/Data] [get_bd_addr_segs Overlaying/GPIO_dim_register/S_AXI/Reg]
assign_bd_address -offset 0x81260000 -range 64K -target_address_space [get_bd_addr_spaces Zynq_PS/processing_system7_0/Data] [get_bd_addr_segs Overlaying/GPIO_BAR_register/S_AXI/Reg]
assign_bd_address -offset 0x83000000 -range 64K -target_address_space [get_bd_addr_spaces Zynq_PS/processing_system7_0/Data] [get_bd_addr_segs ISP/axi_vdma_0/S_AXI_LITE/Reg]

validate_bd_design
save_bd_design
